# EAGLE schematic shunt_regulator (EAGLE 6.4)
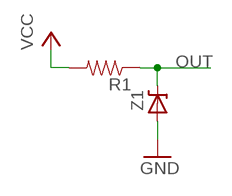
[diagram p0: schematic, sheet 1]

## Parts
R1  RESISTOR0402-RES  [0402-RES]
Z1  DIODE-ZENER-BZT52  [SOD-323]

## Nets
GND: Z1.2(A)
OUT: R1.1 Z1.1(C)
VCC: R1.2

## Library data of the parts
R1 = SparkFun-Passives:RESISTOR: Resistor Basic schematic elements and footprints for 0603, 1206, and PTH resistors.
Z1 = SparkFun-DiscreteSemi:DIODE-ZENER: Zener Diode Production Part - 8199 3.4V Zener Voltage